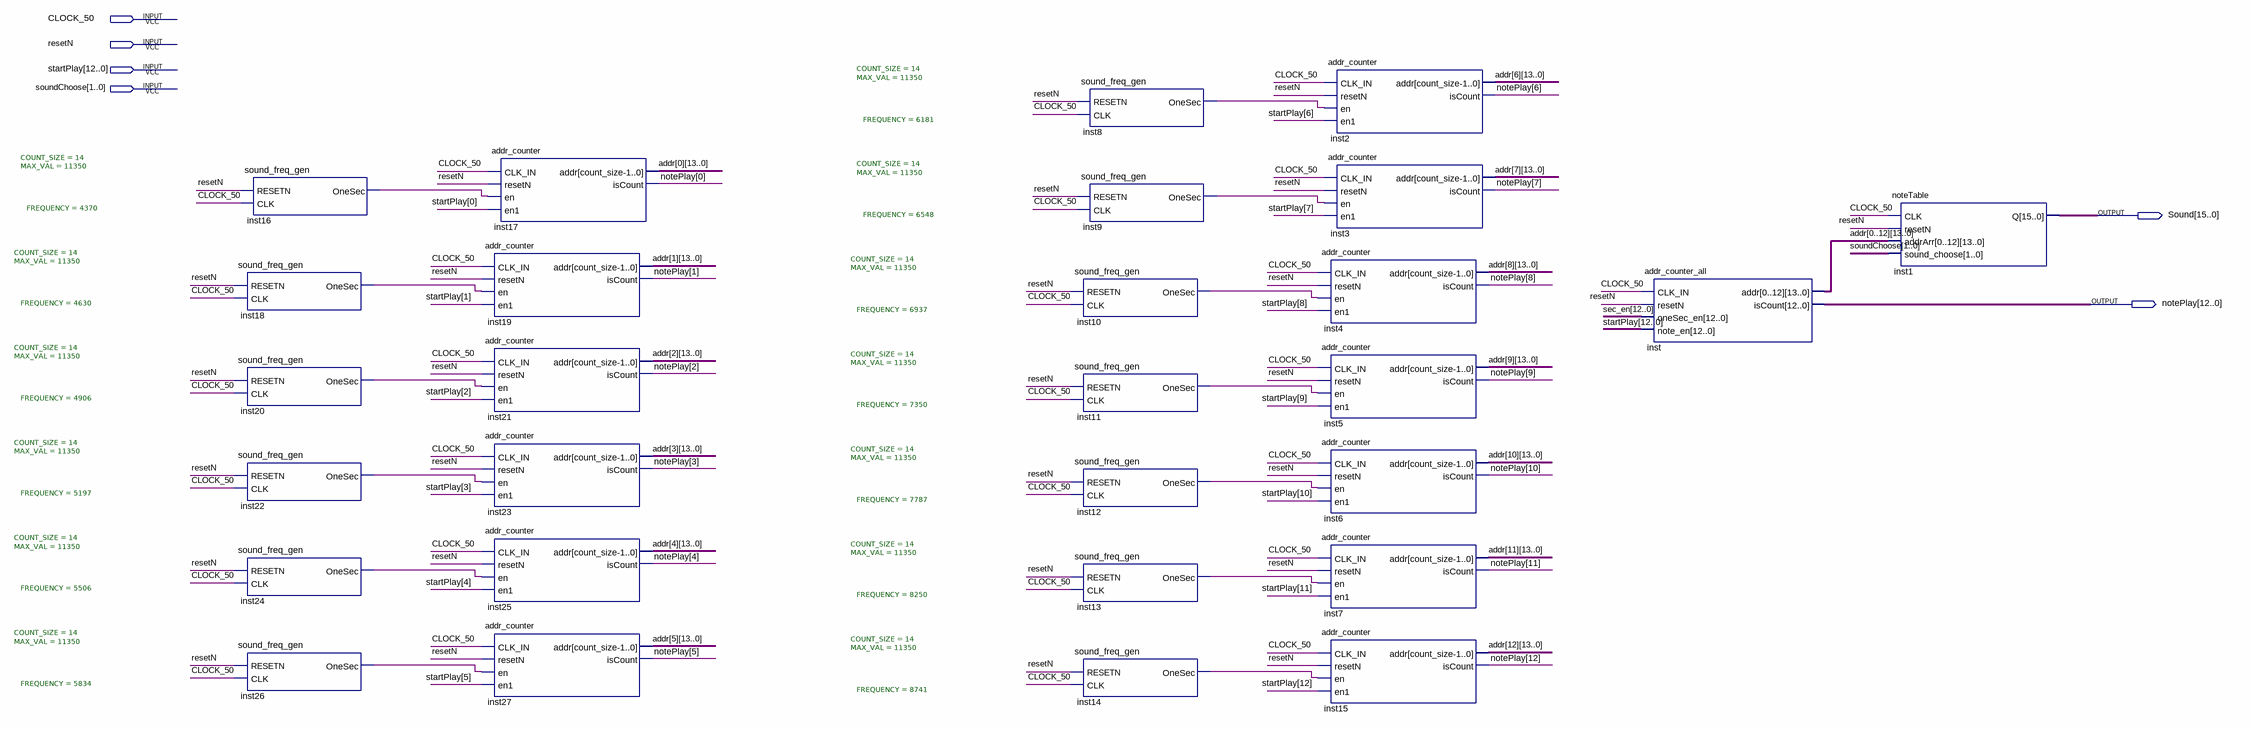
[diagram p0: schematic sheet]
// Quartus schematic notes_top.bdf as structural Verilog: 28 symbols, 6 pins
module notes_top (
  input  CLOCK_50,
  input  resetN,
  input  [12:0] startPlay,
  input  [1:0] soundChoose,
  output [15:0] Sound,
  output [12:0] notePlay
);

  wire inst8_onesec, inst9_onesec, inst10_onesec, inst11_onesec, inst12_onesec, inst13_onesec, inst14_onesec,
       inst16_onesec, inst18_onesec, inst20_onesec, inst22_onesec, inst24_onesec, inst26_onesec;
  wire [12:0] sec_en;
  wire [13:0] addr_0, addr_1, addr_2, addr_3, addr_4, addr_5, addr_6, addr_7, addr_8, addr_9, addr_10,
       addr_11, addr_12;

  sound_freq_gen #(.FREQUENCY(4370)) inst16 (.RESETN(resetN), .CLK(CLOCK_50), .OneSec(inst16_onesec));
  sound_freq_gen #(.FREQUENCY(4630)) inst18 (.RESETN(resetN), .CLK(CLOCK_50), .OneSec(inst18_onesec));
  sound_freq_gen #(.FREQUENCY(4906)) inst20 (.RESETN(resetN), .CLK(CLOCK_50), .OneSec(inst20_onesec));
  sound_freq_gen #(.FREQUENCY(5197)) inst22 (.RESETN(resetN), .CLK(CLOCK_50), .OneSec(inst22_onesec));
  sound_freq_gen #(.FREQUENCY(5506)) inst24 (.RESETN(resetN), .CLK(CLOCK_50), .OneSec(inst24_onesec));
  sound_freq_gen #(.FREQUENCY(5834)) inst26 (.RESETN(resetN), .CLK(CLOCK_50), .OneSec(inst26_onesec));
  addr_counter #(.COUNT_SIZE(14), .MAX_VAL(11350)) inst19 (
    .CLK_IN(CLOCK_50), .resetN(resetN), .en(inst18_onesec), .en1(startPlay[1]), .addr(addr_1),
    .isCount(notePlay[1]));
  addr_counter #(.COUNT_SIZE(14), .MAX_VAL(11350)) inst21 (
    .CLK_IN(CLOCK_50), .resetN(resetN), .en(inst20_onesec), .en1(startPlay[2]), .addr(addr_2),
    .isCount(notePlay[2]));
  addr_counter #(.COUNT_SIZE(14), .MAX_VAL(11350)) inst23 (
    .CLK_IN(CLOCK_50), .resetN(resetN), .en(inst22_onesec), .en1(startPlay[3]), .addr(addr_3),
    .isCount(notePlay[3]));
  addr_counter #(.COUNT_SIZE(14), .MAX_VAL(11350)) inst25 (
    .CLK_IN(CLOCK_50), .resetN(resetN), .en(inst24_onesec), .en1(startPlay[4]), .addr(addr_4),
    .isCount(notePlay[4]));
  addr_counter #(.COUNT_SIZE(14), .MAX_VAL(11350)) inst27 (
    .CLK_IN(CLOCK_50), .resetN(resetN), .en(inst26_onesec), .en1(startPlay[5]), .addr(addr_5),
    .isCount(notePlay[5]));
  addr_counter #(.COUNT_SIZE(14), .MAX_VAL(11350)) inst17 (
    .CLK_IN(CLOCK_50), .resetN(resetN), .en(inst16_onesec), .en1(startPlay[0]), .addr(addr_0),
    .isCount(notePlay[0]));
  sound_freq_gen #(.FREQUENCY(6181)) inst8 (.RESETN(resetN), .CLK(CLOCK_50), .OneSec(inst8_onesec));
  sound_freq_gen #(.FREQUENCY(6548)) inst9 (.RESETN(resetN), .CLK(CLOCK_50), .OneSec(inst9_onesec));
  sound_freq_gen #(.FREQUENCY(6937)) inst10 (.RESETN(resetN), .CLK(CLOCK_50), .OneSec(inst10_onesec));
  sound_freq_gen #(.FREQUENCY(7350)) inst11 (.RESETN(resetN), .CLK(CLOCK_50), .OneSec(inst11_onesec));
  sound_freq_gen #(.FREQUENCY(7787)) inst12 (.RESETN(resetN), .CLK(CLOCK_50), .OneSec(inst12_onesec));
  sound_freq_gen #(.FREQUENCY(8250)) inst13 (.RESETN(resetN), .CLK(CLOCK_50), .OneSec(inst13_onesec));
  sound_freq_gen #(.FREQUENCY(8741)) inst14 (.RESETN(resetN), .CLK(CLOCK_50), .OneSec(inst14_onesec));
  addr_counter #(.COUNT_SIZE(14), .MAX_VAL(11350)) inst2 (
    .CLK_IN(CLOCK_50), .resetN(resetN), .en(inst8_onesec), .en1(startPlay[6]), .addr(addr_6),
    .isCount(notePlay[6]));
  addr_counter #(.COUNT_SIZE(14), .MAX_VAL(11350)) inst3 (
    .CLK_IN(CLOCK_50), .resetN(resetN), .en(inst9_onesec), .en1(startPlay[7]), .addr(addr_7),
    .isCount(notePlay[7]));
  addr_counter #(.COUNT_SIZE(14), .MAX_VAL(11350)) inst4 (
    .CLK_IN(CLOCK_50), .resetN(resetN), .en(inst10_onesec), .en1(startPlay[8]), .addr(addr_8),
    .isCount(notePlay[8]));
  addr_counter #(.COUNT_SIZE(14), .MAX_VAL(11350)) inst5 (
    .CLK_IN(CLOCK_50), .resetN(resetN), .en(inst11_onesec), .en1(startPlay[9]), .addr(addr_9),
    .isCount(notePlay[9]));
  addr_counter #(.COUNT_SIZE(14), .MAX_VAL(11350)) inst6 (
    .CLK_IN(CLOCK_50), .resetN(resetN), .en(inst12_onesec), .en1(startPlay[10]), .addr(addr_10),
    .isCount(notePlay[10]));
  addr_counter #(.COUNT_SIZE(14), .MAX_VAL(11350)) inst7 (
    .CLK_IN(CLOCK_50), .resetN(resetN), .en(inst13_onesec), .en1(startPlay[11]), .addr(addr_11),
    .isCount(notePlay[11]));
  addr_counter #(.COUNT_SIZE(14), .MAX_VAL(11350)) inst15 (
    .CLK_IN(CLOCK_50), .resetN(resetN), .en(inst14_onesec), .en1(startPlay[12]), .addr(addr_12),
    .isCount(notePlay[12]));
  addr_counter_all inst (
    .CLK_IN(CLOCK_50), .resetN(resetN), .oneSec_en(sec_en), .note_en(startPlay),
    .addr({addr_0, addr_1, addr_2, addr_3, addr_4, addr_5, addr_6, addr_7, addr_8, addr_9, addr_10, addr_11, addr_12}),
    .isCount(notePlay));
  noteTable inst1 (
    .CLK(CLOCK_50), .resetN(resetN),
    .addrArr({addr_0, addr_1, addr_2, addr_3, addr_4, addr_5, addr_6, addr_7, addr_8, addr_9, addr_10, addr_11, addr_12}),
    .sound_choose(soundChoose), .Q(Sound));
endmodule
